# EAGLE board kulgurpowerMCU3 (EAGLE 6.3)
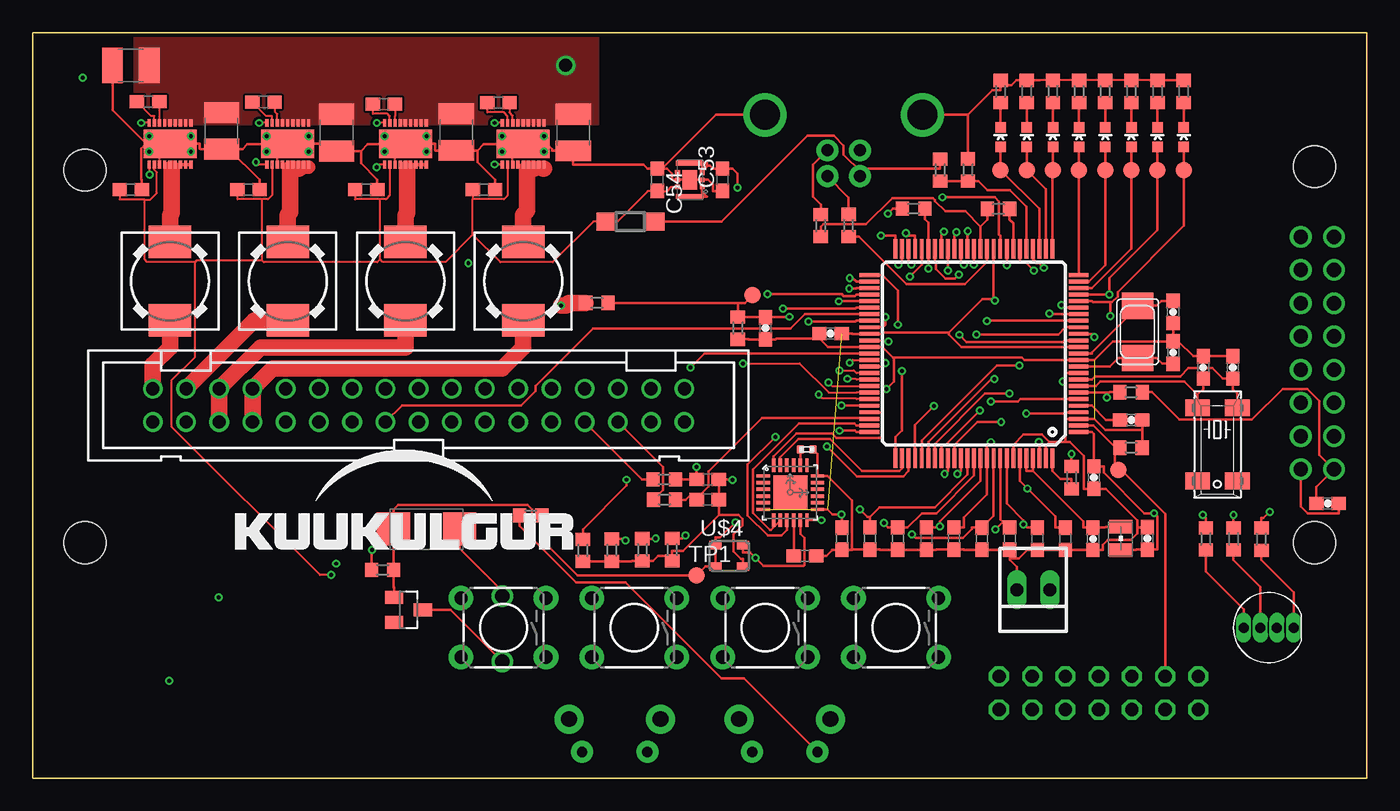
[diagram p6: board, top side]
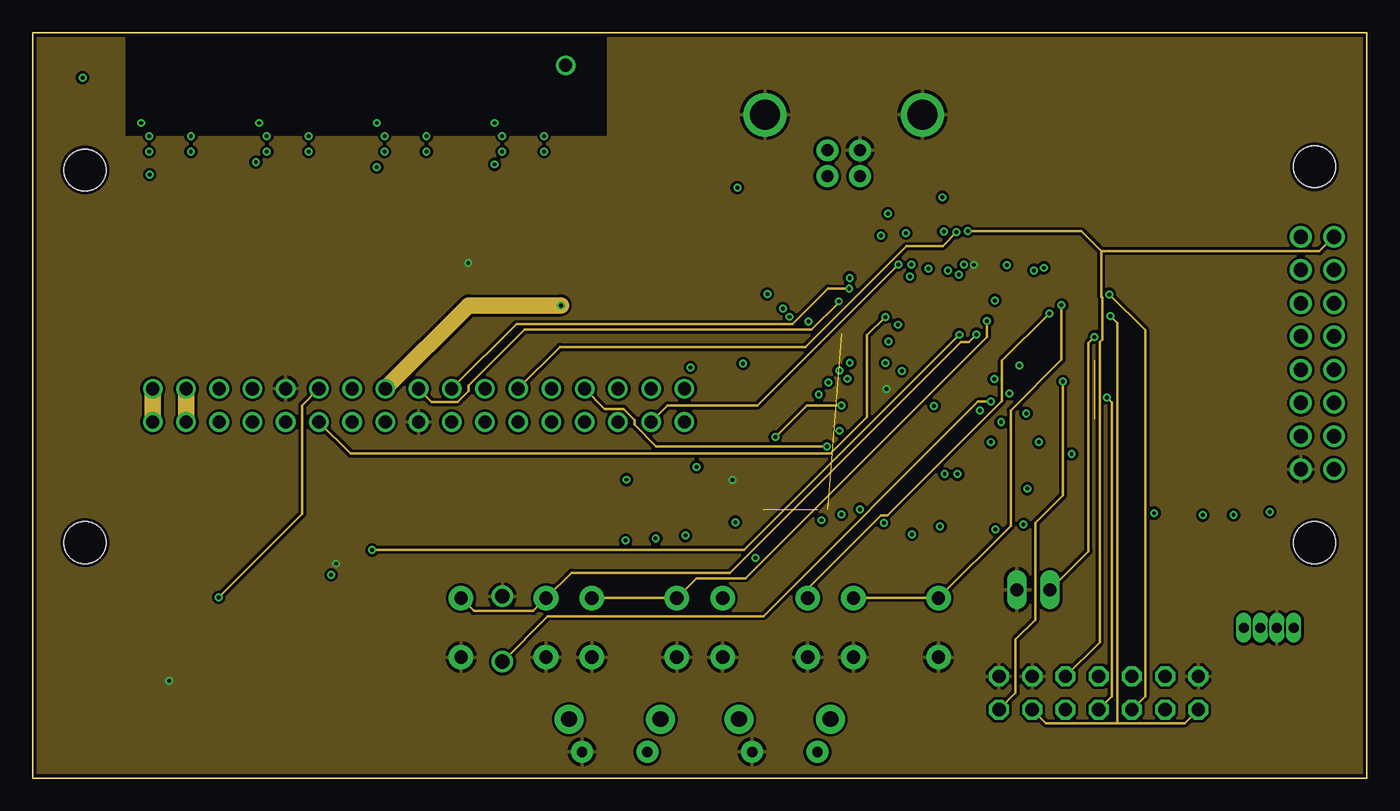
[diagram p7: board, inner layer Route2]
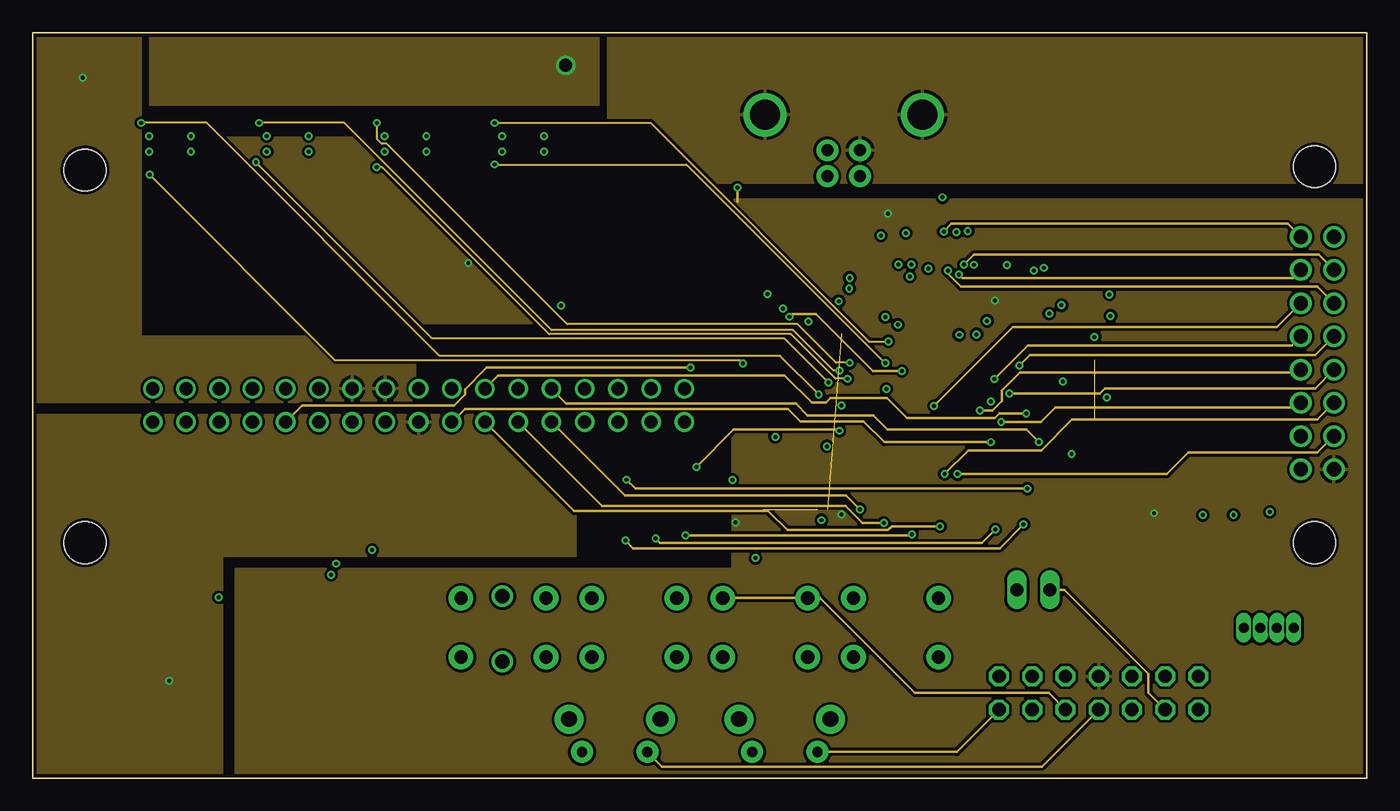
[diagram p8: board, inner layer Route15]
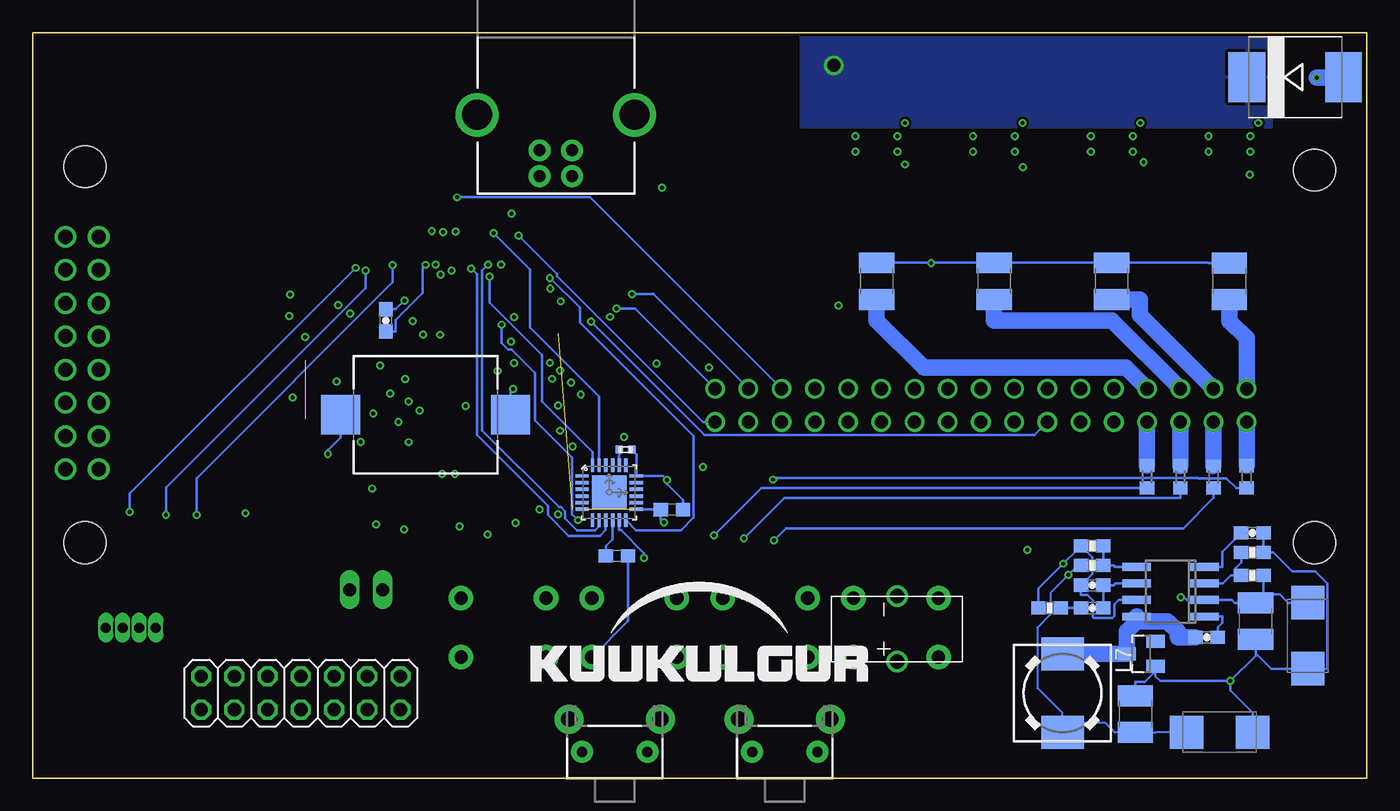
[diagram p9: board, bottom side, seen from below]

Size 102 x 57 mm. Coordinates in mm from the lower left corner, seen from the top.
Outline: 0,0 0,57 102,57 102,0 0,0
Copper layers (1*2*15*16): Top 0.035mm / dielectric 0.2mm / Route2 0.0175mm / dielectric 1.1mm / Route15 0.0175mm / dielectric 0.2mm / Bottom 0.035mm
Design rules "SeeedStudio_DRU_no_angle_20130527": minimum track width 6mil, minimum drill 12mil, track to track 6mil, track to pad 6mil, pad to pad 6mil, via to via 6mil, smd to smd 0mil, copper to edge 10mil, drill to drill 10mil, minimum pad ring 6mil, minimum via ring 6mil, stop-mask expansion 2mil, vias tented up to drill 25mil, thermal gap 10mil
Net classes: 0 default: width 0.203 mm, drill 0.3 mm, clearance 0.203 mm; 1 power: width 0.635 mm, drill 0.6 mm, clearance 0.178 mm; 2 morepower: width 1.27 mm, drill 1 mm, clearance 0.178 mm; 3 thin: width 0.152 mm, drill 0.3 mm, clearance 0.152 mm

## Footprints (pad centres in the part's own frame; a part is rotated, then mirrored left to right if it is on the bottom)
B1,27 = smd 1.27 x 1.27: TP 0,0
C0603 = smd 1.1 x 1: 1 -0.85,0; 2 0.85,0
0603-CAP = smd 1.1 x 1: 1 -0.85,0; 2 0.85,0
C/6032-28R = smd 2.55 x 2.5: + 2.525,0; - -2.525,0
C0402 = smd 0.59 x 0.64: 1 -0.48,0; 2 0.48,0
C1210 = smd 1.6 x 2.7: 1 -1.4,0; 2 1.4,0
SMC = smd 2.8 x 3.8: A 3.7,0; C -3.7,0
SOD123 = smd 1.4 x 1.4: A 1.9,0; C -1.9,0
SOT23 = smd 1 x 1.4: 1 -0.95,-1.1; 2 0.95,-1.1; 3 0,1.1
LED-RGB-THRU = drill 0.762 pad 0.889 long: 1 1.905,0; 2 0.635,0; 3 -0.635,0; 4 -1.905,0
2X07 = drill 1.016 octagon: 1 -7.62,-1.27; 2 -7.62,1.27; 3 -5.08,-1.27; 4 -5.08,1.27; 5 -2.54,-1.27; 6 -2.54,1.27; 7 0,-1.27; 8 0,1.27; 9 2.54,-1.27; 10 2.54,1.27; 11 5.08,-1.27; 12 5.08,1.27; 13 7.62,-1.27; 14 7.62,1.27
WE-KI_0805_B = smd 1.02 x 1.78: 1 -0.89,0; 2 0.89,0
DR73 = smd 2.5 x 3.25: 1 -3,0; 2 3,0
LED-0603 = smd 0.8 x 0.8: A 0,-0.75; C 0,0.75
MM20SS = smd 1.27 x 1.88: 1 -2.794,-1.524; 2 2.794,-1.524; 3 2.794,1.524; 4 -2.794,1.524
R0603 = smd 1 x 1.1: 1 -0.85,0; 2 0.85,0
0603-RES = smd 1.1 x 1: 1 -0.85,0; 2 0.85,0
TACTILE-PTH-SIDEEZ = drill 0.8 pad 1.7: 1 -2.5,0; 2 2.5,0 | drill 1.2 pad 2.2: ANCHOR1 -3.5,2.5; ANCHOR2 3.5,2.5
TACTILE-PTH = drill 1.016 pad 1.88: 1 -3.251,2.261; 2 3.251,2.261; 3 -3.251,-2.261; 4 3.251,-2.261
BUZZER-CMT1102 = smd 3 x 3: 1 -6.5,0; 2 6.5,0
QFN-24-TESTING = smd 1.016 x 0.254: 1 -2.066,1.257; 2 -2.066,0.75; 3 -2.066,0.247; 4 -2.066,-0.287; 5 -2.066,-0.792; 6 -2.066,-1.297; 13 2.086,-1.297; 14 2.086,-0.792; 15 2.086,-0.287; 16 2.086,0.247; 17 2.086,0.75; 18 2.086,1.257 | smd 0.254 x 1.016: 7 -1.267,-2.122; 8 -0.762,-2.122; 9 -0.258,-2.122; 10 0.278,-2.122; 11 0.78,-2.122; 12 1.287,-2.122; 19 1.287,2.082; 20 0.78,2.082; 21 0.278,2.082; 22 -0.258,2.082; 23 -0.762,2.082; 24 -1.267,2.082 | smd 2.616 x 2.616: P$1 0.02,-0.01
EDLRD224V3R6C = drill 1.1: N 2.5,0; P -2.5,0
USB-B-PTH = drill 0.914 pad 1.676: D+ 0,1.25; D- 1.981,1.25; GND 0,-1.25; VBUS 1.981,-1.25 | drill 2.286: S1 -2.718,-6.02; S2 -2.718,6.02
ER-OLEDM032-1 = drill 1.1: P$1 96.2,8.11; P$2 98.74,8.11; P$3 96.2,10.65; P$4 98.74,10.65; P$5 96.2,13.19; P$6 98.74,13.19; P$7 96.2,15.73; P$8 98.74,15.73; P$9 96.2,18.27; P$10 98.74,18.27; P$11 96.2,20.81; P$12 98.74,20.81; P$13 96.2,23.35; P$14 98.74,23.35; P$15 96.2,25.89; P$16 98.74,25.89 | hole 3.2: 3.25,31; 3.25,2.5; 97.25,2.5; 97.25,31.25
ASE = smd 0.9 x 0.65: 1 -1.05,-0.825; 2 1.05,-0.825; 3 1.05,0.825; 4 -1.05,0.825
SO8 = smd 0.6 x 2.2: 1 -1.905,-2.6; 2 -0.635,-2.6; 3 0.635,-2.6; 4 1.905,-2.6; 5 1.905,2.6; 6 0.635,2.6; 7 -0.635,2.6; 8 -1.905,2.6
CL2025 = smd 0.35 x 0.375: P$1 -0.55,-0.938; P$2 0,-0.938; P$3 0.55,-0.938; P$4 0.55,0.938; P$5 0,0.938; P$6 -0.55,0.938 | smd 0.35 x 2.1: P$7 -1.275,0; P$8 1.275,0 | smd 1.5 x 1.1: PAD 0,0
LTQFP100 = smd 1.5 x 0.3: 1 -8,6; 2 -8,5.5; 3 -8,5; 4 -8,4.5; 5 -8,4; 6 -8,3.5; 7 -8,3; 8 -8,2.5; 9 -8,2; 10 -8,1.5; 11 -8,1; 12 -8,0.5; 13 -8,0; 14 -8,-0.5; 15 -8,-1; 16 -8,-1.5; 17 -8,-2; 18 -8,-2.5; 19 -8,-3; 20 -8,-3.5; 21 -8,-4; 22 -8,-4.5; 23 -8,-5; 24 -8,-5.5; 25 -8,-6; 51 8,-6; 52 8,-5.5; 53 8,-5; 54 8,-4.5; 55 8,-4; 56 8,-3.5; 57 8,-3; 58 8,-2.5; 59 8,-2; 60 8,-1.5; 61 8,-1; 62 8,-0.5; 63 8,0; 64 8,0.5; 65 8,1; 66 8,1.5; 67 8,2; 68 8,2.5; 69 8,3; 70 8,3.5; 71 8,4; 72 8,4.5; 73 8,5; 74 8,5.5; 75 8,6 | smd 0.3 x 1.5: 26 -6,-8; 27 -5.5,-8; 28 -5,-8; 29 -4.5,-8; 30 -4,-8; 31 -3.5,-8; 32 -3,-8; 33 -2.5,-8; 34 -2,-8; 35 -1.5,-8; 36 -1,-8; 37 -0.5,-8; 38 0,-8; 39 0.5,-8; 40 1,-8; 41 1.5,-8; 42 2,-8; 43 2.5,-8; 44 3,-8; 45 3.5,-8; 46 4,-8; 47 4.5,-8; 48 5,-8; 49 5.5,-8; 50 6,-8; 76 6,8; 77 5.5,8; 78 5,8; 79 4.5,8; 80 4,8; 81 3.5,8; 82 3,8; 83 2.5,8; 84 2,8; 85 1.5,8; 86 1,8; 87 0.5,8; 88 0,8; 89 -0.5,8; 90 -1,8; 91 -1.5,8; 92 -2,8; 93 -2.5,8; 94 -3,8; 95 -3.5,8; 96 -4,8; 97 -4.5,8; 98 -5,8; 99 -5.5,8; 100 -6,8
CSD97374Q4M = smd 0.25 x 0.6: P$1 -1.6,-1.6; P$2 -1.2,-1.6; P$3 -0.8,-1.6; P$4A -0.4,-1.6; P$4B 0,-1.6; P$4C 0.4,-1.6; P$4D 0.8,-1.6; P$4E 1.2,-1.6; P$4F 1.6,-1.6; P$5A -0.4,1.6; P$5B 0,1.6; P$5C 0.4,1.6; P$5D 0.8,1.6; P$5E 1.2,1.6; P$5F 1.6,1.6; P$6 -0.8,1.6; P$7 -1.2,1.6; P$8 -1.6,1.6 | smd 4.05 x 2.2: PAD@1 0,0 | drill 0.3: PAD@9 -1.6,0.6; PAD@10 -1.6,-0.6; PAD@11 1.6,0.6; PAD@12 1.6,-0.6
NX5032 = smd 2 x 2.4: P$1 2,0; P$2 -2,0
PAK100/2500-34 = drill 1 pad 1.422: 1 -20.32,-1.27; 2 -20.32,1.27; 3 -17.78,-1.27; 4 -17.78,1.27; 5 -15.24,-1.27; 6 -15.24,1.27; 7 -12.7,-1.27; 8 -12.7,1.27; 9 -10.16,-1.27; 10 -10.16,1.27; 11 -7.62,-1.27; 12 -7.62,1.27; 13 -5.08,-1.27; 14 -5.08,1.27; 15 -2.54,-1.27; 16 -2.54,1.27; 17 0,-1.27; 18 0,1.27; 19 2.54,-1.27; 20 2.54,1.27; 21 5.08,-1.27; 22 5.08,1.27; 23 7.62,-1.27; 24 7.62,1.27; 25 10.16,-1.27; 26 10.16,1.27; 27 12.7,-1.27; 28 12.7,1.27; 29 15.24,-1.27; 30 15.24,1.27; 31 17.78,-1.27; 32 17.78,1.27; 33 20.32,-1.27; 34 20.32,1.27
22-23-2021 = drill 1 long: 1 -1.27,0; 2 1.27,0

## Placement (x,y rotation side)
AN0  TPB1,27  [B1,27]  55.05,36.92 90 top
C1  0.1  [C0603]  72.57,18.31 270 top
C2  0.1  [C0603]  74.69,18.32 270 top
C3  0.1  [C0603]  66.13,18.31 270 top
C4  0.1  [0603-CAP]  83.98,27.39 180 top
C5  0.1  [C0603]  64.01,18.32 270 top
C6  18pf  [0603-CAP]  87.19,32.54 270 top
C7  18pf  [0603-CAP]  87.19,35.64 90 top
C8  0.1  [C0603]  76.82,18.3 270 top
C9  [0603-CAP]  89.49,31.41 270 top
C10  0.1  [C0603]  68.32,18.31 270 top
C11  [0603-CAP]  91.76,31.41 270 top
C12  0.1  [0603-CAP]  56.03,34.4 270 top
C13  0,1  [0603-CAP]  81.07,18.3 270 top
C14  0,1  [0603-CAP]  85.23,18.33 90 top
C15  0.1  [C0603]  78.94,18.3 270 top
C17  0.1  [C0603]  70.44,18.32 270 top
C18  [C/6032-28R]  30.11,19.05 180 top
C19  100n  [C0603]  59.05,16.97 0 top
C20  2.2nF / 50V  [C0402]  59.18,25.12 0 top
C21  100n  [C0603]  61.88,18.3 270 top
C22  0.1  [C0603]  51.61,22.83 0 top
C24  100n  [C0603]  57.33,16.98 0 bottom
C25  2.2nF / 50V  [C0402]  56.68,25.11 0 bottom
C26  100n  [C0603]  53.13,20.52 0 bottom
C27  0.1  [C0603]  8.83,51.71 0 top
C28  0.1  [0603-CAP]  12.25,10.75 0 bottom
C29  0.1  [C0603]  25.5,45 0 top
C30  0.1  [C1210]  32.39,49.4 270 top
C31  0.1  [C0603]  17.65,51.69 0 top
C32  0.1  [C0603]  7.5,45 0 top
C33  0.1  [C1210]  41.32,49.36 270 top
C34  0.1  [C0603]  26.85,51.52 0 top
C35  0.1  [C0603]  16.5,45 0 top
C36  0.1  [C1210]  23.24,49.36 270 top
C37  0.1  [C0603]  35.61,51.63 0 top
C38  0.1  [C0603]  34.5,45 0 top
C39  0.1  [C1210]  14.44,49.49 270 top
C40  0.1  [C0603]  51.61,21.29 0 top
C42  [C1210]  10.51,37.98 90 bottom
C43  [C1210]  19.52,38 90 bottom
C44  [C1210]  28.5,38 90 bottom
C45  [C1210]  37.48,38 90 bottom
C46  0,1  [0603-CAP]  61,34 180 top
C47  0,1  [0603-CAP]  75,35 270 bottom
C48  0,1  [0603-CAP]  81.14,22.98 270 top
C49  0,1  [0603-CAP]  99,21 0 top
C50  22uF/25V  [C1210]  7.5,54.5 180 top
C51  12pF  [0603-CAP]  21,14.75 180 bottom
C52  180pF  [0603-CAP]  21,13 180 bottom
C53  10uF / 6.3V  [C0603]  52.75,45.75 90 top
C54  4.7uF / 10V  [C0603]  47.75,45.75 270 top
C55  15nF  [0603-CAP]  8.75,18.75 180 bottom
C56  GRM32ER71E226KE15L  [C1210]  8.5,12 270 bottom
C57  GRM32ER71E226KE15L  [C1210]  17.69,4.89 90 bottom
C58  100uF/16V  [C/6032-28R]  4.51,10.88 90 bottom
C100  100uF/10V  [C/6032-28R]  11.25,3.5 180 bottom
D1  MBRS320T3  [SMC]  5.47,53.59 0 bottom
D2  MBR0520LT  [SOD123]  45.69,42.56 0 top
D7  BAT54  [SOT23]  28.73,12.87 270 top
D8  WP154A4SUREQBFZGW  [LED-RGB-THRU]  94.5,11.5 0 top
D100  BAT54  [SOT23]  17.25,9.5 90 bottom
EMLE  TPB1,27  [B1,27]  82.99,23.58 0 top
JP2  [2X07]  81.5,6.5 0 bottom
L1  4,7uH  [WE-KI_0805_B]  83.19,18.32 90 top
L2  4,7uH  [DR73]  10.5,38 270 top
L3  4,7uH  [DR73]  19.5,38 270 top
L4  4,7uH  [DR73]  28.5,38 270 top
L5  4,7uH  [DR73]  37.5,38 270 top
L7  4,7uH  [DR73]  23.27,6.5 270 bottom
LED0  [LED-0603]  74,49 0 top
LED1  [LED-0603]  76,49 0 top
LED2  [LED-0603]  78,49 0 top
LED3  [LED-0603]  80,49 0 top
LED4  [LED-0603]  82,49 0 top
LED5  [LED-0603]  84,49 0 top
LED6  [LED-0603]  86,49 0 top
LED7  [LED-0603]  88,49 0 top
Q1  [MM20SS]  90.57,25.51 270 top
R1  301k  [R0603]  16.8,23.04 270 bottom
R2  100k  [R0603]  48.89,17.47 270 top
R3  301k  [R0603]  14.26,23.03 270 bottom
R4  100k  [R0603]  46.62,17.45 270 top
R5  47k  [R0603]  83.98,29.51 0 top
R6  47k  [R0603]  26.76,15.91 0 top
R7  1k  [R0603]  74,52.5 270 top
R8  1k  [R0603]  76,52.5 270 top
R9  47k  [R0603]  67.36,43.54 0 top
R10  1k5  [R0603]  73.84,43.51 180 top
R11  301k  [R0603]  11.72,23.02 270 bottom
R12  1k  [R0603]  78,52.5 270 top
R13  100k  [R0603]  44.28,17.42 270 top
R14  1k  [R0603]  80,52.5 270 top
R15  47k  [R0603]  83.97,25.27 0 top
R16  301k  [R0603]  9.19,23.03 270 bottom
R17  100k  [R0603]  42.06,17.4 270 top
R18  100k  [R0603]  53.92,34.4 270 top
R19  1k  [R0603]  79.43,22.96 270 top
R20  100k  [0603-RES]  8.75,15.5 0 bottom
R21  63k4  [0603-RES]  24.25,13 0 bottom
R22  47k  [R0603]  38.08,20.08 180 top
R23  680k  [R0603]  43.14,36.33 180 top
R24  22r  [R0603]  62.37,42.26 90 top
R25  22r  [R0603]  60.25,42.25 90 top
R26  30k  [R0603]  71.5,46.5 90 top
R27  17k  [R0603]  69.38,46.49 270 top
R28  1k  [R0603]  82,52.5 270 top
R29  1k  [R0603]  84,52.5 270 top
R30  1k  [R0603]  86,52.5 270 top
R31  1k  [R0603]  88,52.5 270 top
R32  1k  [R0603]  93.94,18.27 90 top
R33  1k  [R0603]  91.81,18.28 90 top
R34  1k  [R0603]  89.69,18.29 90 top
R35  10k  [R0603]  48.29,22.83 0 top
R36  10k  [R0603]  48.31,21.29 0 top
R37  1k87  [0603-RES]  21,17.75 180 bottom
R38  10k  [0603-RES]  21,16.25 0 bottom
R45  21k5  [0603-RES]  8.75,17.25 180 bottom
S1  PROG  [TACTILE-PTH-SIDEEZ]  44.5,2 0 bottom
S2  SW4  [TACTILE-PTH]  66,11.5 180 top
S6  SW1  [TACTILE-PTH]  36,11.5 180 top
S7  SW2  [TACTILE-PTH]  46,11.5 180 top
S8  SW3  [TACTILE-PTH]  56,11.5 180 top
S9  RESET  [TACTILE-PTH-SIDEEZ]  57.5,2 0 bottom
SG1  BUZZERSMD3  [BUZZER-CMT1102]  71.97,27.79 0 bottom
TP1  TPB1,27  [B1,27]  50.75,15.5 0 top
TPLED0  LED0  [B1,27]  74,46.5 90 top
TPLED1  LED0  [B1,27]  76,46.5 90 top
TPLED2  LED0  [B1,27]  78,46.5 90 top
TPLED3  LED0  [B1,27]  80,46.5 90 top
TPLED4  LED0  [B1,27]  82,46.5 90 top
TPLED5  LED0  [B1,27]  84,46.5 90 top
TPLED6  LED0  [B1,27]  86,46.5 90 top
TPLED7  LED0  [B1,27]  88,46.5 90 top
U1  MPU-6000QFN-24  [QFN-24-TESTING]  57.91,21.84 0 top
U2  MPU-6000QFN-24  [QFN-24-TESTING]  57.93,21.84 0 bottom
U$1  EDLRD224V3R6C  [EDLRD224V3R6C]  35.91,11.4 90 bottom
U$2  USB+SHIELD  [USB-B-PTH]  62,48 270 bottom
U$3  ER-OLEDM032-1  [ER-OLEDM032-1]  0.75,15.5 0 top
U$4  ASE  [ASE]  53.25,17 0 top
U$5  TPS54332  [SO8]  15,14.25 90 bottom
U$6  XCL202B331BR-G  [CL2025]  50.25,45.75 90 top
U$14  R5F5630ADDFP  [LTQFP100]  71.97,32.47 180 top
U$16  CSD97374Q4M  [CSD97374Q4M]  10.5,48.5 0 top
U$17  CSD97374Q4M  [CSD97374Q4M]  19.5,48.5 0 top
U$18  CSD97374Q4M  [CSD97374Q4M]  28.5,48.5 0 top
U$19  CSD97374Q4M  [CSD97374Q4M]  37.5,48.5 0 top
X1  12Mhz  [NX5032]  84.47,34.12 270 top
X2  2534-  [PAK100/2500-34]  29.5,28.5 0 top
X3  22-23-2021  [22-23-2021]  76.5,14.4 180 top

## Tracks (layer width: path | path; a pad name or v marks a point on that pad's centre or on a via)
5V  (via drill 0.3 pad 0.6)
  Top 0.152: 17.55,39.57 12.5,39.57 12.41,39.47 | 26.56,39.67 26.34,39.46 17.66,39.46 17.55,39.57 | 17.55,39.57 17.55,44.27 | 12.41,39.47 8.75,39.47 8.55,39.67 8.55,44.24 | v22.82,15.53 | v22.82,15.53 21.97,15.53 10.64,26.85 10.64,30.45 12.41,32.21 12.41,39.47 | 17.55,44.27 15.65,44.27 C35.1 | U$17.P$2 18.3,44.58 18,44.27 17.55,44.27 | 26.56,39.67 26.56,44.27 | 33.65,41.57 31.55,39.47 26.76,39.47 26.56,39.67 | 26.56,44.27 24.65,44.27 C29.1 | U$18.P$2 27.3,44.56 27.01,44.27 26.56,44.27 | 33.65,41.57 33.65,44.27 | 33.65,41.57 35.77,39.45 39.76,39.45 42.86,42.56 D2.C 44.72,42.56 47.02,44.86 47.02,44.9 C54.2 48.48,44.9 48.78,45.2 U$6.P$6 | U$19.P$2 36.3,44.55 36.02,44.27 33.65,44.27 | C38.1 33.65,44.27 | C32.1 6.65,44.27 8.52,44.27 8.55,44.24 | 8.55,44.24 8.98,44.24 9.49,44.75 9.49,46.34 9.3,46.52 U$16.P$2
  Bottom 0.152: 23.27,4.24 20.02,4.24 19.27,3.49 C57.1 16.11,3.49 16.1,3.5 C100.+ | 23.27,4.24 23.27,4.98 25.19,6.9 25.19,11.49 24.18,12.5 24.18,14.17 v22.82,15.53 22.46,15.89 21.85,15.89 R38.1 | L7.2 23.27,4.24
!OLED_CS  (via drill 0.3 pad 0.6)
  Top 0.203: U$14.39 71.47,41.47 71.49,41.49 v71.49,41.82
  Route2 0.203: JP2.10 81.57,10.38 81.57,33.34 81.77,33.54 81.77,36.74 81.72,36.8 81.72,40.28 | v71.49,41.82 80.17,41.82 81.72,40.28 | U$3.P$16 98.38,40.28 81.72,40.28
!OLED_DC  (via drill 0.3 pad 0.6)
  Top 0.203: U$14.40 70.97,39.47 70.98,39.47 v71.19,39.26
  Route15 0.203: U$3.P$14 98.32,40.02 71.95,40.02 v71.19,39.26
!OLED_RD  (via drill 0.3 pad 0.6)
  Top 0.203: U$14.42 v69.97,38.8
  Route15 0.203: v69.97,38.8 69.97,38.58 70.96,37.58 98.22,37.58 U$3.P$12
!OLED_RESET  (via drill 0.3 pad 0.6)
  Top 0.203: U$14.43 69.47,41.6 v69.65,41.78
  Route15 0.203: v69.65,41.78 70.26,42.39 95.95,42.39 U$3.P$15
!OLED_WR  (via drill 0.3 pad 0.6)
  Top 0.203: U$14.44 68.97,39.47 69.06,39.37 69.06,38.91 69.77,38.21 70.52,38.21 v70.82,38.51
  Route15 0.203: U$3.P$13 96.35,38.25 71.08,38.25 v70.82,38.51
!RESET  (via drill 0.3 pad 0.6)
  Top 0.203: U$14.10 78.97,30.97 78.97,30.54 v78.75,30.33 | S9.1 54.37,7.63 52.65,7.63 45.33,14.96 41.54,14.96 37.23,19.27 R22.2
  Route2 0.203: v78.75,30.33 78.75,21.6 76.65,19.49 76.65,12.1 75.15,10.6 75.15,6.5 JP2.13
  Route15 0.203: JP2.13 70.65,2 S9.1
!SKIP0  (via drill 0.3 pad 0.6)
  Top 0.152: v54.32,31.7 58.64,31.7 60.87,29.47 62.99,29.47 U$14.69 | U$16.P$1 8.9,46.19 v8.95,46.15 v8.94,46.14
  Route15 0.152: v54.32,31.7 54.09,31.93 23.14,31.93 v8.94,46.14
!SKIP1  (via drill 0.3 pad 0.6)
  Top 0.152: v60.84,30.25 61.12,29.97 U$14.68 | U$17.P$1 17.26,46.9 v17.06,47.09
  Route15 0.152: v17.06,47.09 30.51,33.64 57.45,33.64 v60.84,30.25
!SKIP2  (via drill 0.3 pad 0.6)
  Top 0.152: U$18.P$1 26.5,46.9 v26.31,46.71 | U$14.67 62.99,30.47 62.92,30.54 v62.29,30.54
  Route15 0.152: v62.29,30.54 61.38,30.54 57.97,33.95 39.49,33.95 26.73,46.71 v26.31,46.71
!SKIP3  (via drill 0.3 pad 0.6)
  Top 0.152: U$14.65 64.95,31.47 64.95,31.49 v65.19,31.73 | U$19.P$1 35.34,46.9 v35.32,46.93
  Route15 0.152: v35.32,46.93 49.97,46.93 65.17,31.73 v65.19,31.73
!SW1  (via drill 0.3 pad 0.6)
  Top 0.203: U$14.17 78.97,34.47 78.42,33.93 v72.17,33.93
  Route2 0.203: v72.17,33.93 71.58,33.34 70.95,33.34 53.31,15.7 41.19,15.7 S6.3 38.26,12.77 33.74,12.77 S6.4
!SW2  (via drill 0.3 pad 0.6)
  Top 0.203: U$14.18 v72.98,34.97 v72.97,34.96
  Route2 0.203: v72.97,34.96 72.97,33.73 54.5,15.27 50.76,15.27 S7.3 S7.4
!SW3!/TMS  (via drill 0.3 pad 0.6)
  Top 0.203: U$14.19 77.77,35.47 v77.72,35.53
  Route2 0.203: S8.3 59.25,14.48 64.84,20.07 65.34,20.07 74.11,28.84 74.11,31.92 v77.72,35.53
  Route15 0.203: JP2.9 77.69,6.5 67.47,6.5 60.21,13.76 S8.3 S8.4
!SW4!/TDI  (via drill 0.3 pad 0.6)
  Top 0.203: v78.66,36.16 78.85,35.97 78.97,35.97 U$14.20
  Route2 0.203: v78.66,36.16 78.66,31.99 74.79,28.11 74.79,19.3 S2.3 S2.4
!TRST  (via drill 0.3 pad 0.6)
  Top 0.203: v81.18,33.74 81.18,33.76 80.97,33.97 U$14.16
  Route2 0.203: X3.1 80.72,17.34 80.72,33.27 v81.18,33.74
  Route15 0.203: X3.1 78.89,14.4 85.31,7.98 85.31,6.5 JP2.3
+3V3  (via drill 0.3 pad 0.6)  (2 unrouted)
  Top 0.203: 73.47,36.63 v73.57,36.53 | 70.04,34.06 72.6,36.63 73.47,36.63 | 73.47,36.63 U$14.35 | 70.04,34.06 70.04,33.91 71.01,32.94 78.94,32.94 78.97,32.97 U$14.14 | 70.04,34.06 65.07,34.06 64.97,33.97 U$14.60 62.68,33.97 62.65,34 C46.1 | D7.1 27.63,14.57 27.61,14.6 R6.2 27.61,17.52 27.58,17.54 C18.+ 27.58,20.55 27.93,20.9 37.83,20.9 38.17,20.55 38.17,20.08 R22.1 38.93,18.22 41.65,15.5 TP1.TP 51.42,16.18 U$4.1 52.2,17.25 U$4.4 52.2,18.4 52.56,18.4 v53.72,19.56 | C49.1 98.15,22.27 U$3.P$2 98.38,24.72 98.38,28.82 97.43,29.77 95.56,29.77 93.21,27.42 87.67,27.42 85.58,29.51 R5.2 | C21.1 61.88,19.96 61.88,20.12 v61.84,20.16 61.15,20.16 60.76,20.55 U1.13 | v65.38,43.17 65.75,43.54 R9.1 | v53.87,45.14 53.87,46.23 53.5,46.6 C53.2 52,46.6 51.78,46.81 51.55,46.81 | L1.1 84.34,17.43 84.39,17.48 C14.1 85.98,17.48 85.98,20.01 v85.74,20.25 84.99,20.25 81.89,23.35 81.89,23.82 C48.1 81.14,26.31 80.97,26.47 U$14.1 | 51.55,46.81 51.47,46.73 51.19,46.73 U$6.P$3 | 51.55,46.81 51.55,47.02 U$6.P$8
  Route15 0.203: 53.87,44.09 v53.87,45.14
  Bottom 0.203: v73.57,36.53 74.25,35.85 C47.1 | v53.72,19.56 53.93,19.77 53.98,19.77 C26.1 54.01,20.52 54.16,20.52 54.79,20.52 54.81,20.55 U2.13
  pour Route15: 15.5,0 15.5,16 53.5,16 53.5,44.25 102,44.25 102,0
+19V  (via drill 0.3 pad 0.6)
  Top 1.27: R23.2 40.97,36.33 40.78,36.14 v40.39,36.14
  Route2 1.27: X2.16 33.33,36.14 v40.39,36.14
  Bottom 1.27: v3.81,53.55 1.81,53.55 D1.A
  pour Route15: 29.25,28.75 0,28.75 0,57 8.25,57 8.25,33.75 29.25,33.75
AN0  (via drill 0.3 pad 0.6)
  Top 0.203: U$14.76 65.97,26.08 66.45,26.56 v66.45,31.12 | v57.86,35.27 57.84,35.25 C12.1 54.73,35.25 54.72,35.25 R18.1 53.91,36.01 53.91,36.33 | 53.91,36.33 54.46,36.33 AN0.TP | R23.1 53.91,36.33
  Route15 0.203: v66.45,31.12 64.25,31.12 59.89,35.48 58.07,35.48 v57.86,35.27
AN1  (via drill 0.3 pad 0.6)
  Top 0.203: v61.67,26.56 62.87,26.56 62.97,26.47 U$14.75 | v50.76,23.8 C22.1 49.89,22.84 R35.2
  Route15 0.203: v61.67,26.56 61.6,26.64 53.6,26.64 v50.76,23.8
AN3
  Top 0.203: U$14.73 63.92,27.52 55.74,27.52 51.66,23.44 51.66,22.29 51.03,21.66 50.76,21.66 | R36.2 49.91,21.29 50.29,21.66 50.76,21.66 | C40.1 50.76,21.66
AVCC0
  Top 0.203: 76.47,23.47 80.31,19.62 80.31,19.15 C13.1 81.98,19.15 82.05,19.21 L1.2 | 76.47,23.47 76.47,23.57 U$14.97 | U$14.96 75.97,23.47 76.47,23.47
BAT0_EN  (via drill 0.3 pad 0.6)
  Top 0.203: v50.28,31.4 51.36,32.47 U$14.63
  Route15 0.203: X2.9 20.61,28.5 32.2,28.5 33.04,29.34 33.04,29.72 34.72,31.4 v50.28,31.4
BAT1_EN  (via drill 0.3 pad 0.6)
  Top 0.203: v65.18,35.26 65.18,34.68 64.97,34.47 U$14.59
  Route2 0.203: X2.11 24.3,24.81 61,24.81 63.79,27.6 63.79,33.87 v65.18,35.26
BAT2_EN  (via drill 0.3 pad 0.61)
  Top 0.203: U$14.58 62.97,34.97 62.89,34.89 v59.31,34.89
  Bottom 0.203: X2.13 25.43,26.22 50.64,26.22 v59.31,34.89
BAT3_EN
  Top 0.203: X2.15 28.23,28.5 37.33,28.5 38.44,29.61 38.44,29.98 42.83,34.37 57.93,34.37 59.03,35.47 62.97,35.47 U$14.57
BUZZER
  Top 0.203: R19.2 79.43,22.87 78.57,22.87 77.97,23.47 U$14.100
BUZZER_X  (via drill 0.3 pad 0.6)
  Top 0.203: R19.1 v79.43,24.77
  Bottom 0.203: v79.43,24.77 79.43,25.07 78.47,26.04 SG1.1
COMPUTER_PWR  (via drill 0.3 pad 0.6)
  Top 0.203: v60.72,25.37 63.02,23.06 66.56,23.06 66.97,23.47 U$14.78
  Route2 0.203: v60.72,25.37 47.67,25.37 46.01,27.03 46.01,27.4 45.17,28.23 43.74,28.23 X2.28
CPOUT1
  Top 0.203: U1.20 C20.1
CPOUT2
  Bottom 0.203: U2.20 C25.1
D0  (via drill 0.3 pad 0.6)
  Top 0.203: U$14.86 70.97,23.47 70.94,23.47 v70.71,23.24
  Route15 0.203: v70.71,23.24 86.72,23.24 88.36,24.88 98.22,24.88 U$3.P$4
D1  (via drill 0.3 pad 0.6)
  Top 0.203: U$14.85 70.47,25.47 72.21,27.21 v74.04,27.21
  Route15 0.203: U$3.P$5 96.58,28.32 78.2,28.32 77.09,27.21 v74.04,27.21
D2  (via drill 0.3 pad 0.6)
  Top 0.203: U$14.84 69.97,23.47 69.94,23.47 v69.72,23.25
  Route15 0.203: v69.72,23.25 71.53,25.06 77.11,25.06 79.47,27.42 98.22,27.42 U$3.P$6
D3  (via drill 0.3 pad 0.6)
  Top 0.203: U$14.83 69.47,25.47 69.77,25.47 v72.42,28.12
  Route15 0.203: v72.42,28.12 73.39,28.12 74.11,28.84 74.11,29.63 75.48,31 96.72,31 U$3.P$7
D4  (via drill 0.3 pad 0.6)
  Top 0.203: v74.68,29.41 72.82,29.41 68.97,25.56 U$14.82
  Route15 0.203: U$3.P$8 98.06,29.8 81.98,29.8 81.58,29.41 v74.68,29.41
D5  (via drill 0.3 pad 0.6)
  Top 0.203: U$14.81 68.47,25.69 73.28,30.5 v73.51,30.5
  Route15 0.203: U$3.P$9 96.27,33.09 76.09,33.09 v73.51,30.5
D6  (via drill 0.3 pad 0.6)
  Top 0.203: v75.45,31.55 73.72,31.55 67.97,25.8 67.97,25.47 U$14.80
  Route15 0.203: v75.45,31.55 76.25,32.35 98.07,32.35 U$3.P$10
D7  (via drill 0.3 pad 0.6)
  Top 0.203: v68.92,28.45 67.47,27.01 U$14.79
  Route15 0.203: U$3.P$11 95.12,34.48 74.94,34.48 v68.92,28.45
D+
  Top 0.203: R25.2 60.25,43.85 59.65,44.46 59.65,46.9 U$2.D+
D-
  Top 0.203: U$2.D- 62.38,44.39 R24.2
EMLE
  Top 0.203: U$14.2 81.09,26.97 82.75,25.31 82.75,25.27 | 82.75,25.27 82.75,23.82 EMLE.TP 83.22,23.58 86.58,20.21 JP2.4 | R15.1 82.75,25.27
ENABLE_PANDA
  Bottom 0.203: R45.2 9.6,16.5 10.03,16.07 10.03,15.5 | 10.03,15.5 10.4,15.5 11.02,14.88 U$5.3 | R20.1 10.03,15.5
ENABLE_PWR  (via drill 0.3 pad 0.61)
  Top 0.203: U$14.34 73.97,41.47 73.88,41.57 73.88,44.09 73.55,44.41 v69.55,44.41
  Bottom 0.203: X2.30 59.38,44.41 v69.55,44.41
EXTAL
  Top 0.203: U$14.13 80.97,32.47 80.97,32.52 84.57,36.12 | X1.P$2 84.57,36.12 | 84.57,36.12 84.79,36.12 85.93,36.12 86.3,36.49 C7.2
GND  (via drill 0.3 pad 0.6)  (1 unrouted)
  Top 0.14: 37.17,48.17 36.82,47.82 36.7,47.7 U$19.P$3 | 37.5,48.46 U$19.PAD@1 | 10.38,48.38 9.83,47.83 9.7,47.7 U$16.P$3 | U$18.P$3 27.7,47.7 27.83,47.83
  Top 0.152: 85.4,53.35 R29.1 R28.1 R14.1 R12.1 77,53.35
  Top 0.203: 52.46,20.12 53.98,20.12 54.28,19.82 54.28,19.32 53.6,18.64 53.6,17.31 54.16,16.75 54.3,16.75 U$4.2 | 52.46,20.12 49.72,17.37 48.89,17.37 48.89,17 | 52.46,20.12 C40.2 C22.2 53.27,22.84 53.3,22.8 v53.49,22.8 | C38.2 35.35,45.75 34,47.11 34,48 | 36.82,47.82 36.18,48.46 34.46,48.46 34,48 | 34,48 C30.2 30.79,48 30.78,48.01 30.78,48.5 U$18.PAD@1 27.83,47.83 27.2,48.46 25.59,48.46 25.09,47.96 | 37.17,48.17 37.46,48.46 37.5,48.46 39.35,48.46 39.72,48.09 39.72,47.96 C33.2 41.32,46.91 46.69,46.91 47,46.6 C54.1 48.13,46.6 | 78.97,25.7 77.72,25.7 | 78.97,25.7 79.31,25.7 80.38,24.62 80.38,22.12 C48.2 82.04,22.12 84.47,19.69 84.47,19.18 | 78.97,25.7 78.97,27.47 U$14.3 81.18,27.47 82.02,26.64 84.82,26.64 | 77.72,25.7 77.47,25.44 U$14.99 | 77.72,25.7 77.15,26.27 75.76,26.27 74.97,25.47 U$14.94 | 65.84,32.16 65.78,32.16 64.97,32.97 U$14.62 60.8,32.97 60.15,33.62 | v65.27,29.75 65.84,30.32 65.84,32.16 | 65.84,32.16 75.63,32.16 75.82,31.97 U$14.12 81.16,31.97 82.58,33.39 C6.1 | 25.09,47.96 25.09,47.01 26.35,45.75 C29.2 | 25.09,47.96 24.84,47.96 C36.2 22.7,48.5 U$17.PAD@1 18.83,47.83 | 15,48.09 17.33,45.75 17.35,45.75 C35.2 | 62.65,17.47 62.65,21.21 60.76,23.1 U1.18 60,24.78 C20.2 | C11.1 C9.1 88.73,32.26 87.59,33.39 C6.1 | 15,48.09 16.05,48.09 16.41,48.46 18.2,48.46 18.83,47.83 | 15,48.09 C39.2 12.84,48.09 12.78,48.15 12.78,48.5 U$16.PAD@1 10.38,48.38 | U$17.P$3 18.7,47.7 18.83,47.83 | 48.89,17 47.82,17 47.42,16.61 R4.2 45.82,16.61 45.78,16.57 R13.2 42.88,16.57 42.86,16.55 R17.2 | R2.2 48.89,17 | v71.97,39.25 71.97,39.47 U$14.38 | 60.15,33.62 56.86,33.62 56.78,33.55 C12.2 54.73,33.55 54.72,33.55 R18.2
  Top 0.203: C46.2 60.15,33.62 | C49.2 99.85,20.25 97.49,20.25 96.95,20.79 U$3.P$1 | C18.- 32.63,17.54 35.91,14.26 U$1.N | 84.82,26.64 84.83,26.64 C4.1 | R15.2 84.82,26.64 | 74.69,16.78 75.4,16.78 76.06,17.45 C8.2 78.19,17.45 C15.2 80.31,17.45 | 74.69,16.78 74.69,16.66 74.72,16.66 75.23,16.15 X3.2 | 74.69,16.78 C2.2 73.94,17.47 73.93,17.46 C1.2 71.2,17.46 71.19,17.47 C17.2 69.08,17.47 69.07,17.46 C10.2 66.89,17.46 | 48.13,46.6 52.24,50.72 U$2.S2 | 48.13,46.6 48.5,46.6 48.87,46.23 48.87,45.75 U$6.P$5 U$6.PAD U$6.P$2 51.63,45.75 52,45.38 52,44.9 C53.1 | C6.1 C7.1 | 80.31,17.45 C13.2 81.82,17.45 81.82,17.82 82.2,18.2 83.97,18.2 84.47,18.71 84.47,19.18 | 74,52.97 74.82,52.97 75.2,53.35 R8.1 77,53.35 | 74,52.97 74,52.6 73.38,52.6 71.5,50.72 | R7.1 74,52.97 | 71.5,50.72 | 71.5,50.72 U$2.S1 | R26.2 71.5,50.72 | 66.89,17.46 C3.2 64.77,17.46 64.76,17.47 C5.2 62.65,17.47 | 62.65,17.47 62.63,17.45 C21.2 61.12,17.45 61.12,17.39 60.7,16.97 C19.2 | 8.68,48.5 8.3,48.12 8.3,45.81 8.35,45.75 C32.2 | 9.83,47.83 9.15,48.5 8.68,48.5 | C50.2 6.1,51.08 8.68,48.5 | 85.4,53.35 R30.1 R31.1 | 80.31,17.45 | 66.89,17.46 | C14.2 84.47,19.18
  Bottom 0.203: v71.97,39.25 72.2,39.01 72.2,37.07 74.25,35.03 74.25,34.15 C47.2 | 33.31,39.4 C44.2 C43.2 12.14,39.4 12.11,39.38 C42.2 | C45.2 33.31,39.4 | v33.31,39.38 33.31,39.4 | C25.2 55.85,24.76 U2.18 53.79,23.1 v53.49,22.8 53.49,22.49 52.28,21.28 C26.2 | C57.2 17.69,7.34 16.98,7.34 16.15,8.17 | 16.15,8.17 16.15,7.8 15.78,7.43 v10.42,7.43 | D100.1 16.15,8.17 | 8.5,9.55 8.5,9.35 v10.42,7.43 | v10.42,7.43 10.42,6.7 8.72,5 C100.- | 8.5,9.55 7.31,8.36 C58.- 3.76,8.36 3.01,8.36 3.01,14.87 3.93,15.79 5.69,15.79 7.15,17.25 R45.1 C55.1 | C56.2 8.5,9.55 | 21.85,17.42 21.51,17.42 20.98,16.89 20.98,15.62 C51.2 21.85,14 21.38,14 20.95,13.57 20.95,12.33 20.87,12.25 19.44,12.25 19.29,12.4 19.29,13.28 18.95,13.62 U$5.7 | v23.21,16.39 22.18,17.42 21.85,17.42 | 21.85,17.42 R37.2 | S8.1 56.48,12.01 C24.2 | v65.27,29.75 65.47,29.55 SG1.2 | v23.21,16.39 | R21.1 25.1,14.5 v23.21,16.39
  pour Route15: 14.5,0.25 14.5,17 41.5,17 41.5,27.75 0,27.75 0,0.25
  pour Route15: 102,57 102,45.5 52.25,45.5 52.25,34.75 9.5,34.75 9.5,49 44,49 44,57
  pour Route2: 0,57 0,0 102,0 102,57 44,57 44,49 7,49 7,57
IBAT0_AD  (via drill 0.3 pad 0.6)
  Top 0.203: C17.1 71.19,19.17 71.19,19.92 72.97,21.7 U$14.90 72.97,24.97 72.97,25.47 73.06,25.47 v73.27,25.68
  Route15 0.203: v73.27,25.68 | v73.27,25.68 65.1,25.68 63.52,27.27 58.7,27.27 57.74,28.23 33.04,28.23 X2.19
IBAT1_AD  (via drill 0.3 pad 0.6)
  Top 0.203: U$14.89 72.47,22.71 69.38,19.62 v69.38,19.24 69.15,19.24 69.07,19.16 C10.1
  Route15 0.203: v69.38,19.24 65.69,19.24 65.4,18.96 57.69,18.96 56.23,20.42 41.39,20.42 X2.21
IBAT2_AD  (via drill 0.3 pad 0.6)
  Top 0.203: v65.07,19.51 65.07,19.47 65.38,19.16 C3.1 66.89,19.16 67.97,20.25 69.08,20.25 71.97,23.13 U$14.88
  Route15 0.203: v65.07,19.51 63.44,19.51 62.12,20.82 43.53,20.82 X2.23
IBAT3_AD  (via drill 0.3 pad 0.6)
  Top 0.203: v63.25,20.55 63.83,19.97 64.01,19.97 | U$14.87 71.47,23.21 68.96,20.7 64.73,20.7 64.01,19.97 | C5.1 64.01,19.97
  Route15 0.203: X2.25 45.27,21.62 62.18,21.62 v63.25,20.55
IMON1
  Top 0.203: R35.1 46.59,22.84 X2.27
IMON2
  Top 0.203: X2.29 48.19,23.78 48.19,22.01 R36.1
INT_GYRO1  (via drill 0.3 pad 0.6)
  Top 0.203: U$14.51 64.97,38.47 66.16,37.28 v66.16,34.66 | U1.12 v60.31,19.72
  Bottom 0.203: v60.31,19.72 60.76,20.17 60.76,24.52 63.58,27.34 63.58,30.98 65.38,32.79 65.67,32.79 66.16,33.27 v66.16,34.66
INT_GYRO2  (via drill 0.3 pad 0.6)
  Top 0.203: U$14.52 62.97,37.97 62.69,38.25 v62.47,38.25
  Bottom 0.203: v62.47,38.25 v62.45,38.25 60.17,35.96 60.17,34.83 51.48,26.14 51.48,19.91 52.45,18.94 55.87,18.94 U2.12
LED0
  Top 0.203: U$14.28 76.97,43.53 TPLED0.TP LED0.A
LED1
  Top 0.203: LED1.A TPLED1.TP 77.47,45.03 U$14.27
LED2
  Top 0.203: LED2.A TPLED2.TP 77.97,46.47 U$14.26
LED3
  Top 0.203: U$14.25 80,38.5 TPLED3.TP LED3.A
LED4
  Top 0.203: U$14.24 80.74,37.97 82,39.23 TPLED4.TP LED4.A
LED5
  Top 0.203: U$14.23 80.97,37.47 84,40.5 TPLED5.TP LED5.A
LED6/TDO  (via drill 0.3 pad 0.6)
  Top 0.203: U$14.22 80.97,36.97 80.99,36.99 v82.31,36.99 82.31,38.23 86,41.92 TPLED6.TP LED6.A
  Route2 0.203: v82.31,36.99 85.06,34.24 85.06,6.25 JP2.5
LED7/TCK  (via drill 0.3 pad 0.6)
  Top 0.203: U$14.21 80.97,36.47 81.05,36.39 82.41,36.39 | 82.41,36.39 82.52,36.39 82.95,36.83 82.95,37.18 88,42.23 TPLED7.TP LED7.A | 82.41,36.39 v82.41,35.34
  Route2 0.203: 82.95,4.2 88.09,4.2 JP2.1 | JP2.11 77.45,4.2 82.95,4.2 | v82.41,35.34 82.95,34.8 82.95,4.2
LED_BLUE  (via drill 0.3 pad 0.61)
  Top 0.203: R34.2 89.69,19.89 89.68,19.89 v89.46,20.11 | U$14.33 v74.47,39.23
  Bottom 0.203: v89.46,20.11 89.46,22.92 74.47,37.91 v74.47,39.23
LED_GREEN  (via drill 0.3 pad 0.6)
  Top 0.203: v76.56,38.82 75.91,39.47 75.47,39.47 U$14.31 | v91.81,20.11 R33.2
  Bottom 0.203: v91.81,20.11 91.81,22.22 76.56,37.47 v76.56,38.82
LED_RED  (via drill 0.3 pad 0.6)
  Top 0.203: U$14.29 76.47,39.67 76.75,39.39 76.94,39.39 v77.32,39.02 | R32.2 93.94,19.88 94.1,19.88 v94.59,20.36
  Bottom 0.203: v94.59,20.36 94.59,21.75 v77.32,39.02
LX
  Top 0.203: U$6.P$1 51.19,44.77 51.26,44.77 51.55,44.48 U$6.P$7
MD  (via drill 0.3 pad 0.6)
  Top 0.203: 82.13,29.47 v82.13,29.09 | 82.13,29.47 82.33,29.47 82.37,29.51 R5.1 | U$14.7 82.13,29.47
  Route2 0.203: JP2.7 82.52,6.25 82.52,28.7 v82.13,29.09
  Route15 0.203: JP2.7 77.15,0.88 48.12,0.88 S1.1
MISOA  (via drill 0.3 pad 0.6)
  Top 0.203: v68.47,38.95 U$14.45 68.47,42.48 68.21,42.74 R9.2
  Bottom 0.203: v68.47,38.95 68.04,38.52 68.04,26.21 62.62,20.79 62.62,20.12 61.02,18.52 58.63,18.52 58.19,18.96 U2.9
MISOB  (via drill 0.3 pad 0.6)
  Top 0.203: v56.78,26.08 54.67,23.97 54.67,20.09 56.2,18.56 57.25,18.56 57.65,18.96 U1.9 | U$14.71 62.97,28.47 62.93,28.5 v61.83,28.5
  Route2 0.203: v56.78,26.08 59.2,28.5 v61.83,28.5
MOSIA  (via drill 0.3 pad 0.6)
  Top 0.203: v67.07,38.36 67.97,39.25 67.97,39.47 U$14.46
  Bottom 0.203: U2.24 59.2,24.93 63.07,28.8 63.07,32.36 67.07,36.36 v67.07,38.36
MOSIB
  Top 0.203: U1.24 56.64,24.59 58.39,26.33 61.12,26.33 61.45,25.99 64.79,25.99 64.97,26.18 64.97,27.97 U$14.72
N$2
  Top 0.203: R7.2 LED0.C
N$3
  Top 0.203: U$14.5 80.97,28.47 82.06,27.39 C4.2
N$4
  Top 0.203: R32.1 93.94,16.67 96.41,14.2 D8.1
N$8
  Top 0.203: R8.2 LED1.C
N$9
  Top 0.203: R12.2 LED2.C
N$10
  Top 0.203: R14.2 LED3.C
N$11
  Top 0.203: R28.2 LED4.C
N$12
  Top 0.203: R29.2 LED5.C
N$13
  Top 0.203: R30.2 LED6.C
N$14
  Top 0.203: R31.2 LED7.C
N$15
  Top 0.203: R33.1 91.81,16.68 93.86,14.62 D8.3
N$17
  Top 0.203: D8.4 92.59,12.9 89.69,15.8 R34.1
N$18
  Top 0.152: C37.1 34.76,50.9 36.03,50.9 36.3,50.63 U$19.P$7
N$19
  Top 0.152: U$17.P$7 18.3,50.63 17.86,50.63 C31.1
N$20
  Top 0.14: C37.2 36.46,50.91 36.7,50.66 U$19.P$6
N$21
  Top 0.14: C31.2 18.5,50.97 18.7,50.77 U$17.P$6
N$22
  Top 0.152: U$16.P$7 9.3,50.63 9.06,50.63 C27.1
N$23
  Top 0.14: C27.2 9.68,50.98 9.7,50.96 U$16.P$6
N$24
  Top 0.152: C34.1 26,50.79 27.14,50.79 27.3,50.63 U$18.P$7
N$25
  Top 0.14: U$18.P$6 27.7,50.62 | C34.2 27.7,50.62 | 27.7,50.62
N$26  (via drill 0.3 pad 0.6)
  Top 0.203: U1.11 58.69,18.68 59,18.37 59,16.3 58.91,16.22 55.86,16.22 v55.26,16.82 54.83,17.25 54.3,17.25 U$4.3
  Bottom 0.203: U2.11 57.15,18.96 57.04,18.96 55.26,17.19 v55.26,16.82
N$96
  Bottom 0.203: U$5.4 11.05,16.16 11.05,17.3 C55.2
N$109
  Bottom 0.203: C52.1 C51.1 19.35,14.75 19.21,14.88 U$5.6
N$120
  Bottom 0.203: R21.2 C52.2
N$121
  Bottom 0.203: C28.2 11.4,11.5 11.05,11.86 11.05,12.35 U$5.1
N$125
  Bottom 0.203: 19.75,16.25 20.15,16.65 R37.1 | 19.75,16.25 19.35,16.25 19.25,16.16 U$5.5 | R38.2 19.75,16.25
N$138
  Bottom 1.27: 17.6,11.97 15.23,11.97 14.46,11.2 14.46,10.75 C28.1 | 17.6,11.97 18.35,11.22 D100.3 19.86,9.5 19.87,9.5 L7.1 | U$5.8 17.6,11.97
NMI  (via drill 0.3 pad 0.6)
  Top 0.203: R6.1 25.91,17.38 v25.96,17.43 | U$14.15 78.89,33.47 78.78,33.36 71.38,33.36 v70.84,33.9
  Route2 0.203: v70.84,33.9 54.37,17.43 v25.96,17.43
OUT1_EN  (via drill 0.3 pad 0.6)
  Top 0.203: U$14.55 62.97,36.47 62.95,36.46 v61.63,36.46
  Route2 0.203: X2.18 30.5,28.77 32.47,28.77 33.31,29.6 33.31,30 37.59,34.28 59.55,34.28 61.63,36.36 v61.63,36.46
OUT2_EN  (via drill 0.3 pad 0.6)
  Top 0.203: U$14.53 62.97,37.47 62.93,37.44 v62.43,37.44
  Route2 0.203: X2.20 36.98,34.72 58.09,34.72 60.81,37.44 v62.43,37.44
OUT3_EN  (via drill 0.3 pad 0.6)
  Top 0.203: U$14.4 78.97,27.97 78.88,27.89 v75.96,27.89
  Route15 0.203: v75.96,27.89 73.93,27.89 73.58,27.54 66.83,27.54 65.3,29.06 60.99,29.06 60.64,28.71 59.57,28.71 57.49,30.78 35.59,30.78 X2.22
OUT4_EN  (via drill 0.3 pad 0.6)
  Top 0.203: v70.63,41.73 70.47,41.58 U$14.41
  Route2 0.203: X2.24 40.32,32.97 59.1,32.97 66.81,40.68 69.57,40.68 v70.63,41.73
OUT5_EN  (via drill 0.3 pad 0.6)
  Top 0.203: U$14.98 76.97,25.64 v76.93,25.69
  Route15 0.203: X2.26 40.79,28.64 58.34,28.64 59.24,27.74 64.26,27.74 65.35,26.66 75.95,26.66 v76.93,25.69
PGOOD1  (via drill 0.3 pad 0.6)
  Top 0.203: v66.19,39.26 66.39,39.47 66.47,39.47 U$14.49
  Route2 0.203: X2.31 48.55,28.5 55.43,28.5 v66.19,39.26
PGOOD2  (via drill 0.3 pad 0.6)
  Top 0.203: v64.84,41.47 65.97,41.47 U$14.50
  Bottom 0.203: v64.84,41.47 61.91,38.54 61.91,38.39 50.75,27.23 X2.33
PWM0  (via drill 0.3 pad 0.6)
  Top 0.152: v60.1,29.32 60.39,29.03 62.93,29.03 62.99,28.97 U$14.70 | U$16.P$8 v8.29,50.1
  Route15 0.152: v60.1,29.32 57.14,32.28 31.12,32.28 13.3,50.1 v8.29,50.1 | v8.29,50.1
PWM1  (via drill 0.3 pad 0.6)
  Top 0.152: U$17.P$8 v17.3,50.1 | U$14.66 62.99,30.97 62.79,31.17 v61.67,31.17
  Route15 0.152: v61.67,31.17 61.21,31.17 58.13,34.25 39.67,34.25 23.83,50.1 v17.3,50.1 | v17.3,50.1
PWM2  (via drill 0.3 pad 0.6)
  Top 0.152: U$18.P$8 v26.32,50.1 | v62.46,31.76 62.67,31.97 U$14.64
  Route15 0.152: v62.46,31.76 61.43,31.76 58.49,34.7 40.87,34.7 27.07,48.5 26.68,48.5 26.32,48.86 v26.32,50.1
PWM3  (via drill 0.3 pad 0.6)
  Top 0.152: v65.42,33.39 65.02,33.39 64.95,33.47 U$14.61 | U$19.P$8 v35.3,50.1
  Route15 0.152: v35.3,50.1 47.23,50.1 63.94,33.39 v65.42,33.39
PWM4  (via drill 0.3 pad 0.6)
  Top 0.203: v57.36,35.9 62.9,35.9 62.97,35.97 U$14.56
  Bottom 0.203: X2.34 55.95,35.9 v57.36,35.9
PWM5  (via drill 0.3 pad 0.6)
  Top 0.203: v56.17,37.01 61.86,37.01 61.99,36.88 62.87,36.88 62.97,36.97 U$14.54
  Bottom 0.203: X2.32 54.52,37.01 v56.17,37.01
REGOUT1
  Top 0.203: C19.1 58.2,17.73 58.19,17.73 U1.10
REGOUT2
  Bottom 0.203: U2.10 57.66,18.26 58.18,17.74 C24.1
RSPCKA  (via drill 0.3 pad 0.6)
  Top 0.203: v66.77,41.68 66.97,41.47 67.47,41.47 U$14.47
  Bottom 0.203: U2.23 58.69,29.16 63.97,34.44 63.97,38.89 v66.77,41.68
RSPCKB
  Top 0.203: U1.23 57.15,24.51 58.56,25.92 60.95,25.92 63.41,23.47 66.26,23.47 66.47,23.67 U$14.77
SSLA0  (via drill 0.3 pad 0.6)
  Top 0.203: v67.18,39.26 66.97,39.47 U$14.48
  Bottom 0.203: U2.8 58.69,19.23 58.99,18.93 60.36,18.93 61.29,19.86 61.29,20.39 61.61,20.72 61.77,20.72 67.63,26.58 67.63,38.81 v67.18,39.26
SSLB0
  Top 0.203: U1.8 57.15,19.68 56.45,18.98 56.36,18.98 55.08,20.25 55.08,23.6 58.6,27.12 62.82,27.12 62.97,26.97 U$14.74
SUPERCAP  (via drill 0.3 pad 0.6)
  Top 0.203: U$14.6 75.52,28.97 75.33,28.78 v73.27,28.78 | U$1.P 31.94,12.87 D7.3
  Route2 0.203: v73.27,28.78 72.27,28.78 55.86,12.37 39.38,12.37 U$1.P
USB0_DM
  Top 0.203: R24.1 63.18,41.41 66.81,37.77 71.28,37.77 72.97,39.46 U$14.36
USB0_DP
  Top 0.203: R25.1 60.25,42.15 60.44,42.34 63.7,42.34 65.71,44.35 68.83,44.35 68.99,44.2 68.99,44.13 69.77,43.35 71.3,43.35 72.47,42.19 | 72.47,42.19 72.99,42.71 R10.2 | U$14.37 72.47,42.19
USB0_DPUPE
  Top 0.203: R10.1 74.69,42.71 74.97,42.43 U$14.32
USB0_VBUS
  Top 0.203: R27.2 70.18,45.64 70.19,45.65 R26.1 72.3,45.65 72.99,44.97 74.71,44.97 75.97,43.7 U$14.30
V+  (via drill 0.3 pad 0.6)
  Route2 0.203: X2.12 20.61,28.5 20.61,20.21 v14.21,13.82
  Bottom 0.203: v14.21,13.82 13.96,13.82 13.75,13.62 U$5.2 10.32,13.62 10.1,13.4 8.75,13.4 | 7.9,14.05 6.66,14.05 6.02,13.41 C58.+ | 8.75,13.4 8.1,14.05 7.9,14.05 | 7.9,14.05 R20.2 | C56.1 8.75,13.4
VBAT0
  Top 1.27: L2.2 10.5,32.94 9.18,31.62 X2.2
  Route2 1.27: X2.2 X2.1
  Bottom 1.27: X2.1 R16.1 | C42.1 10.51,34.96 9.18,33.63 X2.2
VBAT0_AD  (via drill 0.3 pad 0.6)
  Top 0.203: v45.41,22.81 45.41,22.36 42.06,19.01 R17.1 | U$14.95 75.47,22.71 v76.05,22.13 78.19,19.99 78.19,19.15 C15.1
  Route15 0.203: v76.05,22.13 46.09,22.13 v45.41,22.81
  Bottom 0.203: v45.41,22.81 45.28,22.95 15.44,22.95 15.43,22.94 12.91,22.94 12.89,22.93 10.73,22.93 9.99,22.18 R16.2
VBAT1
  Top 1.27: X2.4 16.95,35 L3.2
  Route2 1.27: X2.4 X2.3
  Bottom 1.27: C43.1 17.36,36.6 17.36,35.41 X2.4 | R11.1 X2.3
VBAT1_AD  (via drill 0.3 pad 0.6)
  Top 0.203: v45.33,18.16 45.2,18.16 45.08,18.27 R13.1 | U$14.93 74.47,20.99 75.76,19.7 v75.76,19.39 75.82,19.39 76.06,19.15 C8.1
  Route15 0.203: v45.33,18.16 45.91,17.58 73.94,17.58 v75.76,19.39
  Bottom 0.203: v45.33,18.16 44.39,19.1 14.04,19.1 11.72,21.42 R11.2
VBAT2
  Top 1.27: L4.2 28.5,32.94 17.43,32.94 X2.6 X2.5
  Bottom 1.27: X2.5 R3.1 | C44.1 28.5,34.99 19.48,34.99 X2.6
VBAT2_AD  (via drill 0.3 pad 0.6)
  Top 0.203: v47.63,18.32 47.43,18.32 47.42,18.3 R4.1 | 74.17,19.57 v73.61,19.01 | 74.17,19.57 74.69,19.57 C2.1 | 74.17,19.57 73.97,19.77 U$14.92
  Route15 0.203: v47.63,18.32 47.97,17.98 72.58,17.98 v73.61,19.01
  Bottom 0.203: v47.63,18.32 44.52,21.43 14.26,21.43 R3.2
VBAT3
  Top 1.27: L5.2 37.5,32.94 35.9,31.33 18.36,31.33 X2.8 X2.7
  Bottom 1.27: C45.1 37.48,34.99 33.88,31.38 18.41,31.38 X2.8 | R1.1 16.8,25.2 X2.7
VBAT3_AD  (via drill 0.3 pad 0.6)
  Top 0.203: v49.91,18.54 49.69,18.32 R2.1 | v67.22,18.64 67.51,18.36 71.1,18.36 71.81,19.07 71.81,19.16 C1.1 73.47,20.06 U$14.91
  Route15 0.203: v67.22,18.64 67.12,18.54 v49.91,18.54
  Bottom 0.203: v49.91,18.54 46.26,22.19 R1.2
VBUS
  Top 0.203: 63.35,46.34 63.31,46.3 63.31,46.08 U$2.VBUS | 63.35,46.34 63.6,46.59 69.38,46.59 R27.1 | 63.35,46.34 62,47.69 62,48.35 61.25,49.11 59.22,49.11 52.67,42.56 D2.A
VIN  (via drill 1 pad 1.5)
  other vias: 40.75,54.5
  pour Top (isolate 0.1, no thermals): 7.75,57 7.75,50 43.25,50 43.25,57
  pour Bottom: 7.25,57 7.25,49.75 43.25,49.75 43.25,57
  pour Route15: 9,56.75 9,51.5 43.25,51.5 43.25,56.75
VSW0
  Top 0.14: U$16.P$4A U$16.P$4B
  Top 0.25: U$16.P$4F U$16.P$4E U$16.P$4D U$16.P$4C 10.76,46.76 10.64,46.76 | 10.64,46.59 10.64,46.76 | 10.64,46.76 U$16.P$4B
  Top 1.27: L2.1 10.5,43.06 10.64,43.2 10.64,46.59
VSW1
  Top 0.14: 19.32,46.9 U$17.P$4B | U$17.P$4A 19.3,46.9
  Top 0.25: 20.39,46.59 U$17.P$4E 20.89,46.71 | 19.7,46.9 19.7,46.59 | 19.7,46.9 U$17.P$4C U$17.P$4D 20.3,46.59 | U$17.P$4B 19.7,46.9 | 19.3,46.9 19.32,46.9 | 21.1,46.71 U$17.P$4F
  Top 1.016: 21.1,46.71 20.89,46.71
  Top 1.27: 19.7,46.59 19.7,43.26 19.5,43.06 L3.1 | 20.39,46.59 20.3,46.59
VSW2
  Top 0.14: U$18.P$4A 28.3,46.9 | 28.32,46.9 U$18.P$4B
  Top 0.25: 28.3,46.9 28.32,46.9 | U$18.P$4F U$18.P$4E U$18.P$4D U$18.P$4C 28.76,46.76 28.64,46.76 | 28.64,46.59 28.64,46.76 | 28.64,46.76 U$18.P$4B
  Top 1.27: 28.64,46.59 28.64,43.2 28.5,43.06 L4.1
VSW3
  Top 0.15: U$19.P$4A U$19.P$4B
  Top 0.25: 38.39,46.81 U$19.P$4D | 38.31,46.59 38.39,46.66 38.39,46.81 | 38.39,46.81 38.61,46.81 U$19.P$4E 39.01,46.59 | 37.7,46.7 U$19.P$4C 38.21,46.59 | U$19.P$4B 37.7,46.7 | 37.7,46.7 | 37.7,46.7 | 37.81,46.59 37.7,46.7 | 39.1,46.59 U$19.P$4F
  Top 1.27: 38.31,46.59 38.21,46.59 | L5.1 37.5,43.06 37.81,43.38 37.81,46.59 | 39.1,46.59 39.01,46.59
XCIN
  Top 0.203: 89.05,29.31 89.49,29.75 C9.2 | Q1.1 89.05,29.31 | U$14.8 81.28,29.97 81.63,30.32 88.04,30.32 89.05,29.31
XCOUT
  Top 0.203: U$14.9 80.97,30.47 81.23,30.73 87.73,30.73 88.36,31.36 90.2,31.36 91,30.55 C11.2 91.76,29.75 92.1,29.41 Q1.4
XTAL
  Top 0.203: C6.2 86.35,31.69 85.93,32.12 X1.P$1 83.02,32.12 82.37,31.47 U$14.11